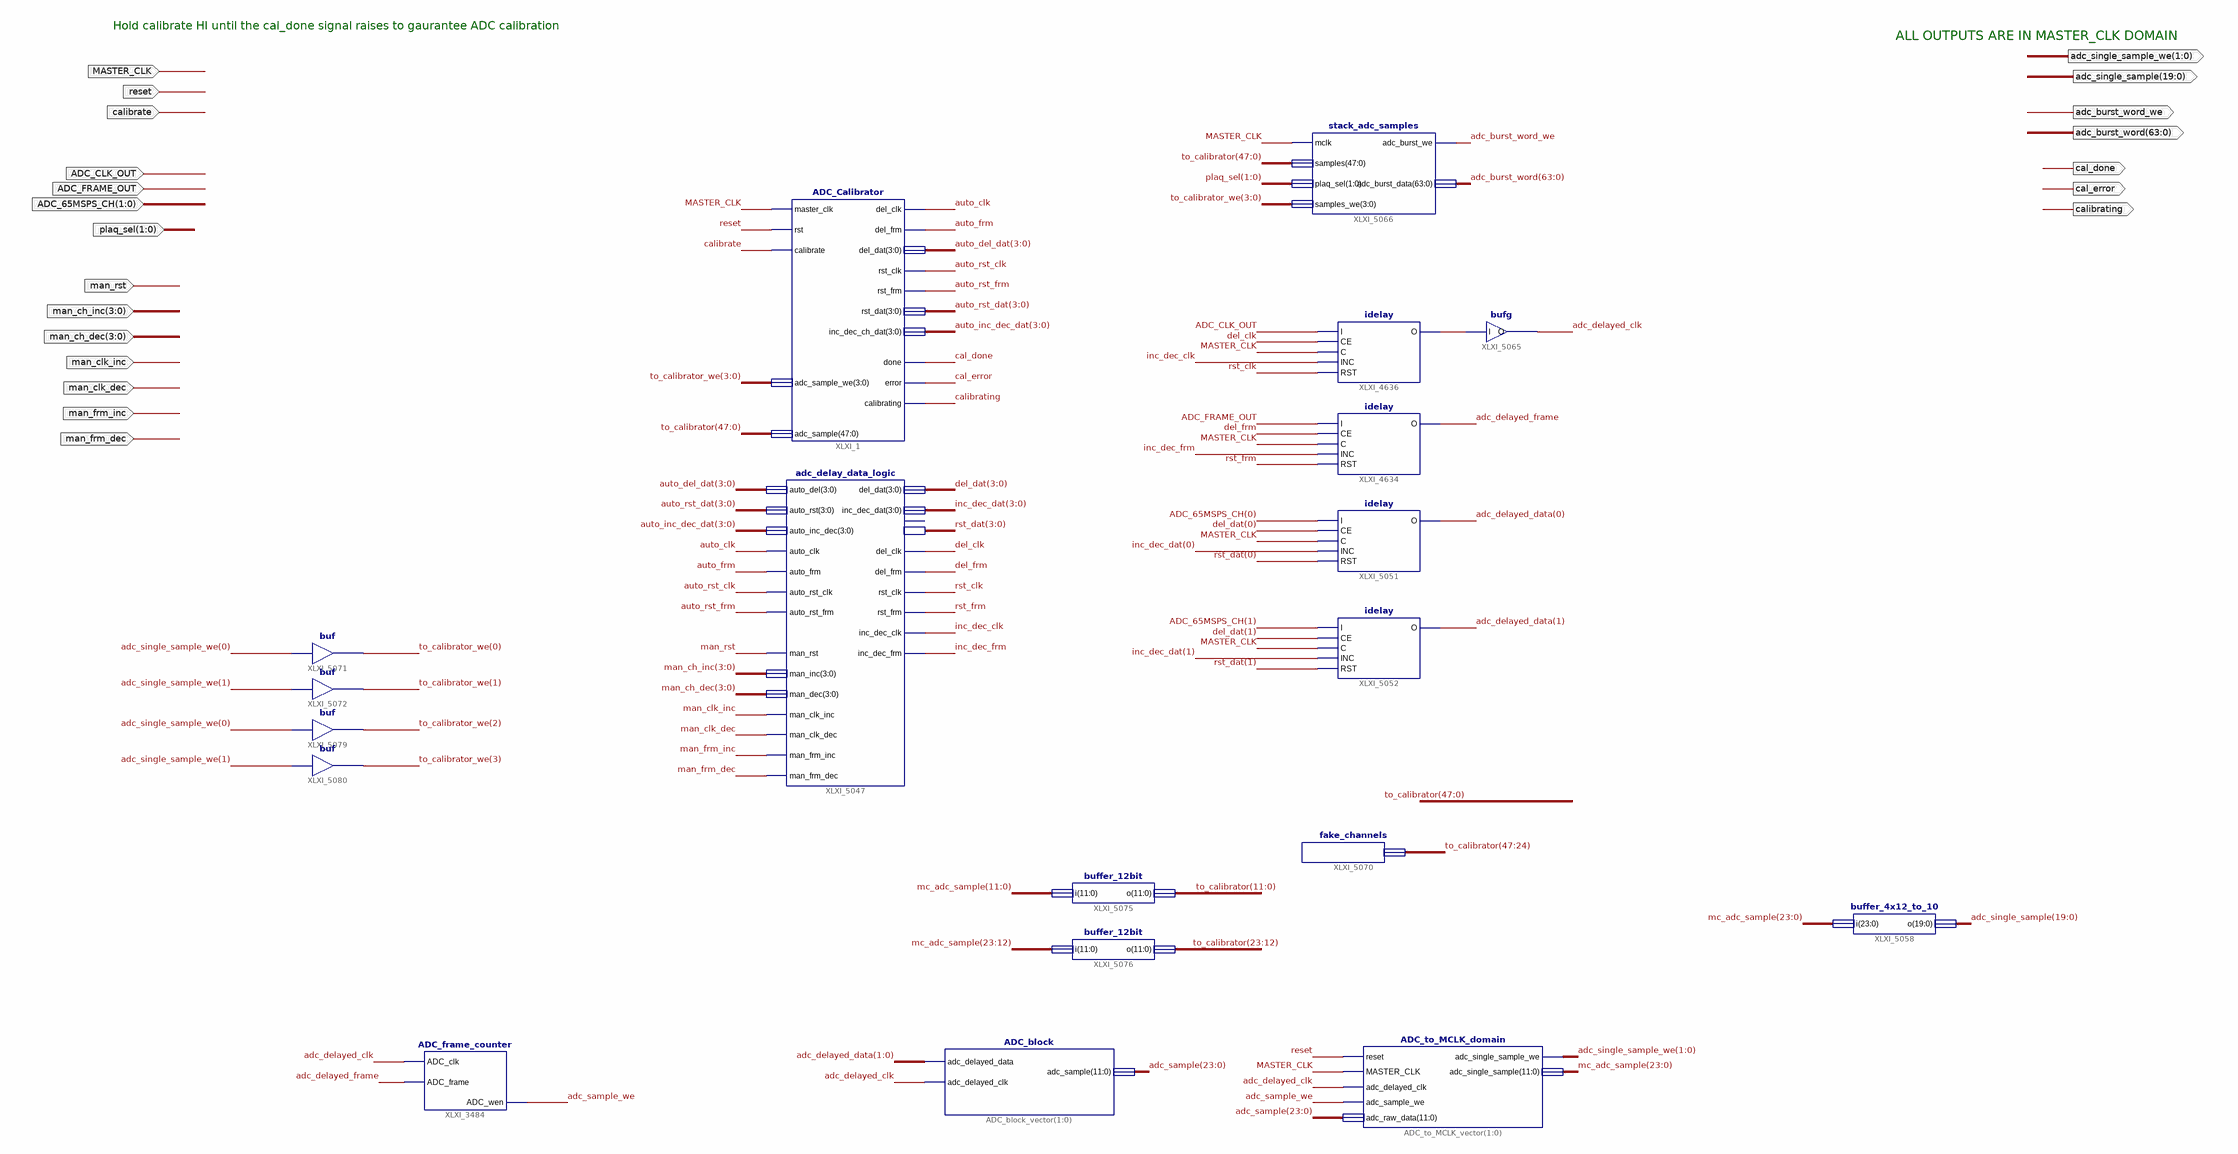
[diagram p0: schematic sheet 1]
// Xilinx ISE schematic ADC_channel_block.sch (virtex4) as structural Verilog: 19 symbols, 21 ports
module ADC_channel_block (
  input  MASTER_CLK,
  input  reset,
  input  calibrate,
  input  ADC_FRAME_OUT,
  input  ADC_CLK_OUT,
  input  [3:0] man_ch_inc,
  input  [3:0] man_ch_dec,
  input  [1:0] ADC_65MSPS_CH,
  input  man_rst,
  input  man_clk_inc,
  input  man_clk_dec,
  input  man_frm_inc,
  input  man_frm_dec,
  input  [1:0] plaq_sel,
  output cal_error,
  output cal_done,
  output [1:0] adc_single_sample_we,
  output calibrating,
  output [63:0] adc_burst_word,
  output adc_burst_word_we,
  output [19:0] adc_single_sample
);

  wire adc_delayed_clk, adc_delayed_frame, adc_sample_we, auto_clk, auto_frm, auto_rst_clk, auto_rst_frm,
       del_clk, del_frm, inc_dec_clk, inc_dec_frm, rst_clk, rst_frm, XLXN_14691;
  wire [1:0] adc_delayed_data;
  wire [3:0] auto_del_dat, auto_inc_dec_dat, auto_rst_dat, del_dat, inc_dec_dat, rst_dat, to_calibrator_we;
  wire [23:0] adc_sample, mc_adc_sample;
  wire [47:0] to_calibrator;

  ADC_Calibrator XLXI_1 (
    .master_clk(MASTER_CLK), .rst(reset), .calibrate(calibrate), .adc_sample_we(to_calibrator_we),
    .adc_sample(to_calibrator), .del_clk(auto_clk), .del_frm(auto_frm), .rst_clk(auto_rst_clk),
    .rst_frm(auto_rst_frm), .done(cal_done), .calibrating(calibrating), .error(cal_error),
    .del_dat(auto_del_dat), .rst_dat(auto_rst_dat), .inc_dec_ch_dat(auto_inc_dec_dat));
  adc_delay_data_logic XLXI_5047 (
    .man_clk_inc(man_clk_inc), .man_clk_dec(man_clk_dec), .man_frm_inc(man_frm_inc),
    .man_frm_dec(man_frm_dec), .del_dat(del_dat), .auto_del(auto_del_dat), .auto_rst(auto_rst_dat),
    .auto_inc_dec(auto_inc_dec_dat), .auto_clk(auto_clk), .auto_frm(auto_frm), .auto_rst_clk(auto_rst_clk),
    .auto_rst_frm(auto_rst_frm), .rst_dat(rst_dat), .inc_dec_dat(inc_dec_dat), .del_clk(del_clk),
    .del_frm(del_frm), .rst_clk(rst_clk), .rst_frm(rst_frm), .inc_dec_clk(inc_dec_clk),
    .inc_dec_frm(inc_dec_frm), .man_inc(man_ch_inc), .man_dec(man_ch_dec), .man_rst(man_rst));
  idelay #(.IOBDELAY_TYPE("VARIABLE")) XLXI_4636 (
    .I(ADC_CLK_OUT), .CE(del_clk), .C(MASTER_CLK), .INC(inc_dec_clk), .RST(rst_clk), .O(XLXN_14691));
  idelay #(.IOBDELAY_TYPE("VARIABLE")) XLXI_4634 (
    .I(ADC_FRAME_OUT), .CE(del_frm), .C(MASTER_CLK), .INC(inc_dec_frm), .RST(rst_frm), .O(adc_delayed_frame));
  idelay #(.IOBDELAY_TYPE("VARIABLE")) XLXI_5051 (
    .I(ADC_65MSPS_CH[0]), .CE(del_dat[0]), .C(MASTER_CLK), .INC(inc_dec_dat[0]), .RST(rst_dat[0]),
    .O(adc_delayed_data[0]));
  idelay #(.IOBDELAY_TYPE("VARIABLE")) XLXI_5052 (
    .I(ADC_65MSPS_CH[1]), .CE(del_dat[1]), .C(MASTER_CLK), .INC(inc_dec_dat[1]), .RST(rst_dat[1]),
    .O(adc_delayed_data[1]));
  buffer_4x12_to_10 XLXI_5058 (.i(mc_adc_sample), .o(adc_single_sample));
  ADC_to_MCLK_domain ADC_to_MCLK_vector[1:0] (
    .reset(reset), .MASTER_CLK(MASTER_CLK), .adc_delayed_clk(adc_delayed_clk), .adc_sample_we(adc_sample_we),
    .adc_raw_data(adc_sample), .adc_single_sample(mc_adc_sample), .adc_single_sample_we(adc_single_sample_we));
  ADC_block ADC_block_vector[1:0] (
    .adc_delayed_data(adc_delayed_data), .adc_delayed_clk(adc_delayed_clk), .adc_sample(adc_sample));
  ADC_frame_counter XLXI_3484 (.ADC_clk(adc_delayed_clk), .ADC_frame(adc_delayed_frame), .ADC_wen(adc_sample_we));
  bufg XLXI_5065 (.I(XLXN_14691), .O(adc_delayed_clk));
  stack_adc_samples XLXI_5066 (
    .mclk(MASTER_CLK), .samples(to_calibrator), .samples_we(to_calibrator_we), .plaq_sel(plaq_sel),
    .adc_burst_we(adc_burst_word_we), .adc_burst_data(adc_burst_word));
  buf XLXI_5071 (to_calibrator_we[0], adc_single_sample_we[0]);
  buf XLXI_5072 (to_calibrator_we[1], adc_single_sample_we[1]);
  fake_channels XLXI_5070 (.fout(to_calibrator[47:24]));
  buffer_12bit XLXI_5075 (.i(mc_adc_sample[11:0]), .o(to_calibrator[11:0]));
  buffer_12bit XLXI_5076 (.i(mc_adc_sample[23:12]), .o(to_calibrator[23:12]));
  buf XLXI_5079 (to_calibrator_we[2], adc_single_sample_we[0]);
  buf XLXI_5080 (to_calibrator_we[3], adc_single_sample_we[1]);

  // Notes on the sheet:
  //   Hold calibrate HI until the cal_done signal raises to gaurantee ADC calibration
  //   ALL OUTPUTS ARE IN MASTER_CLK DOMAIN
endmodule
